# Altium schematic sheet SignalCircuit.SchDoc
size A4
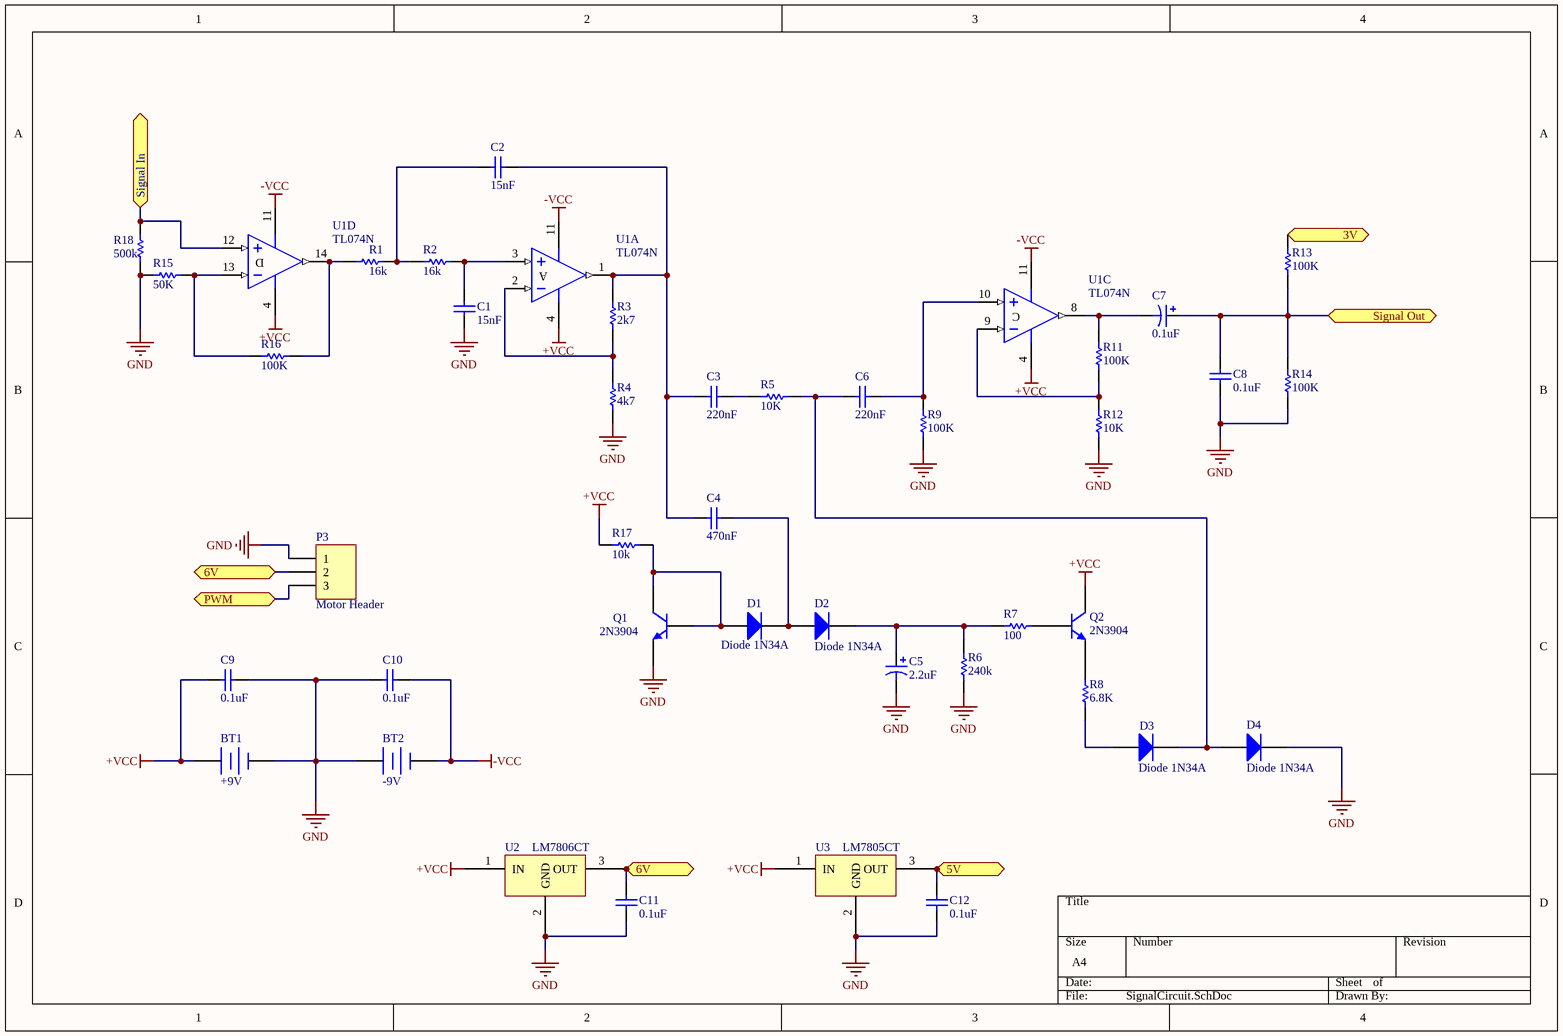
[diagram p0: SignalCircuit.SchDoc]

## Parts
BT1  +9V  [BAT-2]
BT2  -9V  [BAT-2]
C1  15nF  [RAD-0.3]
C2  15nF  [RAD-0.3]
C3  220nF  [RAD-0.3]
C4  470nF  [RAD-0.3]
C5  2.2uF  [RAD0.2-POL]
C6  220nF  [RAD-0.3]
C7  0.1uF  [RAD0.2-POL]
C8  0.1uF  [RAD-0.3]
C9  0.1uF  [RAD-0.3]
C10  0.1uF  [RAD-0.3]
C11  0.1uF  [RAD-0.3]
C12  0.1uF  [RAD-0.3]
D1  Diode 1N34A  [DO-35]
D2  Diode 1N34A  [DO-35]
D3  Diode 1N34A  [DO-35]
D4  Diode 1N34A  [DO-35]
P3  Motor Header  [HDR1X3]
Q1  2N3904  [TO-226AE]
Q2  2N3904  [TO-226AE]
R1  16k  [AXIAL-0.3]
R2  16k  [AXIAL-0.3]
R3  2k7  [AXIAL-0.3]
R4  4k7  [AXIAL-0.3]
R5  10K  [AXIAL-0.3]
R6  240k  [AXIAL-0.3]
R7  100  [AXIAL-0.3]
R8  6.8K  [AXIAL-0.3]
R9  100K  [AXIAL-0.3]
R11  100K  [AXIAL-0.3]
R12  10K  [AXIAL-0.3]
R13  100K  [AXIAL-0.3]
R14  100K  [AXIAL-0.3]
R15  50K  [AXIAL-0.3]
R16  100K  [AXIAL-0.3]
R17  10k  [AXIAL-0.3]
R18  500k  [AXIAL-0.3]
U1  TL074N  [N014]  (parts A,C,D of 4)
U2  LM7806CT  [TO-220]
U3  LM7805CT  [TO-220]

## Ports
3V, 5V, 6V, PWM, Signal In, Signal Out

## Nets
+VCC: BT1.1(+) C9.1 Q2.3(C) R17.2 U1.4(V+) U2.1(IN) U3.1(IN)
-VCC: BT2.2(-) C10.2 U1.11(V-)
GND: BT1.2(-) BT2.1(+) C1.1 C5.2 C8.2 C9.2 C10.1 C11.1 C12.1 D4.2(K) P3.1 Q1.1(E) R4.1 R6.1 R9.1 R12.1 R14.1 R15.2 R18.1 U2.2(GND) U3.2(GND)
3V: R13.2 ; port 3V
5V: C12.2 U3.3(OUT) ; port 5V
6V: C11.2 P3.2 U2.3(OUT) ; port 6V
PWM: P3.3 ; port PWM
Signal In: R18.2 U1.12(IN+) ; port Signal In
Signal Out: C7.1 C8.1 R13.1 R14.2 ; port Signal Out
NetC1_2: C1.2 R2.2 U1.3(IN+)
NetC2_1: C2.1 R1.2 R2.1
NetC2_2: C2.2 C3.1 C4.1 R3.2 U1.1(OUT)
NetC3_2: C3.2 R5.1
NetC4_2: C4.2 D1.2(K) D2.1(A)
NetC5_1: C5.1 D2.2(K) R6.2 R7.1
NetC6_1: C6.1 D3.2(K) D4.1(A) R5.2
NetC6_2: C6.2 R9.2 U1.10(IN+)
NetC7_2: C7.2 R11.2 U1.8(OUT)
NetD1_1: D1.1(A) Q1.2(B) Q1.3(C) R17.1
NetD3_1: D3.1(A) R8.1
NetQ2_1: Q2.1(E) R8.2
NetQ2_2: Q2.2(B) R7.2
NetR1_1: R1.1 R16.1 U1.14(OUT)
NetR3_1: R3.1 R4.2 U1.2(IN-)
NetR11_1: R11.1 R12.2 U1.9(IN-)
NetR15_1: R15.1 R16.2 U1.13(IN-)

## Notes on the sheet
- (in symbol TL074N, part A) A
- (in symbol TL074N, part C) C
- (in symbol TL074N, part D) D

## Library data of the parts
BT1 BT2 = Battery: Multicell Battery; Published: 24-Mar-1999; LatestRevisionDate: 17-Jul-2002; LatestRevisionNote: Re-released for DXP Platform.; PackageReference: BAT-2; Publisher: Altium Limited; PackageDescription: Battery; 2 Leads
C1-C4 C6 C8-C12 = Cap: Capacitor; Published: 8-Jun-2000; LatestRevisionDate: 17-Jul-2002; LatestRevisionNote: Re-released for DXP Platform.; PackageReference: RAD-0.3; Publisher: Altium Limited; PackageDescription: Radial Cap, Thru-Hole; 2 Leads; 0.3 in Pin Spacing
C5 C7 = Cap Pol1: Polarized Capacitor (Radial); Published: 8-Jun-2000; LatestRevisionDate: 17-Jul-2002; LatestRevisionNote: Re-released for DXP Platform.; PackageReference: RB7.6-15; Publisher: Altium Limited; PackageDescription: Polarized Capacitor (Radial); 2 Leads
D1-D4 = Diode 1N914: High Conductance Fast Diode; Published: 8-Jun-2000; LatestRevisionDate: 17-Jul-2002; LatestRevisionNote: Re-released for DXP Platform.; DatasheetVersion: 1997; PackageReference: DO-35; Publisher: Altium Limited; PackageDescription: Diode, Axial; Body 3.8 x 1.9 mm (LxDia. max), Lead Dia. 0.53 mm (max); Code_JEDEC: DO-204-AH; ComponentLink1Description: Manufacturer Link; ComponentLink1URL: http://www.fairchildsemi.com/; ComponentLink2Description: Datasheet; ComponentLink2URL: http://www.fairchildsemi.com/ds/1N%2F1N4448.pdf
P3 = Header 3: Header, 3-Pin; LatestRevisionDate: 17-Jul-2002; LatestRevisionNote: Re-released for DXP Platform.; Publisher: Altium Limited
Q1 Q2 = 2N3904: NPN General Purpose Amplifier; Published: 8-Jun-2000; LatestRevisionDate: 15-Jan-2003; LatestRevisionNote: PCB Footprint 'BCY-W3/D4.7' replaced; DatasheetVersion: 1997; PackageVersion: Sep-1998; PackageReference: TO-92A; Publisher: Altium Limited; PackageDescription: TO, Flat Index; 3 In-Line, Axial Leads; Body Dia. 4.5mm; Leads 0.51 x 0.48 mm (max); ComponentLink1Description: Manufacturer Link; ComponentLink1URL: http://www.fairchildsemi.com/; ComponentLink2Description: Datasheet; ComponentLink2URL: http://www.fairchildsemi.com/ds/2N%2F2N3904.pdf
R1-R9 R11-R18 = Res1: Resistor; Published: 8-Jun-2000; LatestRevisionDate: 17-Jul-2002; LatestRevisionNote: Re-released for DXP Platform.; PackageReference: AXIAL-0.3; Publisher: Altium Limited; PackageDescription: Axial Device, Thru-Hole; 2 Leads; 0.3 in Pin Spacing
U1 = TL074N: Low-Noise JFET-Input Operational Amplifier; Published: 16-Jan-2001; LatestRevisionDate: 04-Mar-2005; LatestRevisionNote: Stylized 3D Model Added.; DatasheetVersion: Aug-1996; PackageVersion: Oct-1995; PackageReference: N014; Publisher: Altium Limited; PackageDescription: DIP; 14 Leads; Row Spacing 7.62 mm; Pitch 2.54 mm; ComponentLink1Description: Manufacturer Link; ComponentLink1URL: http://www.ti.com/; ComponentLink2Description: Datasheet; ComponentLink2URL: http://www-s.ti.com/sc/ds/tl074.pdf
U2 U3 = LM7805CT(3): Three Terminal Voltage Regulator